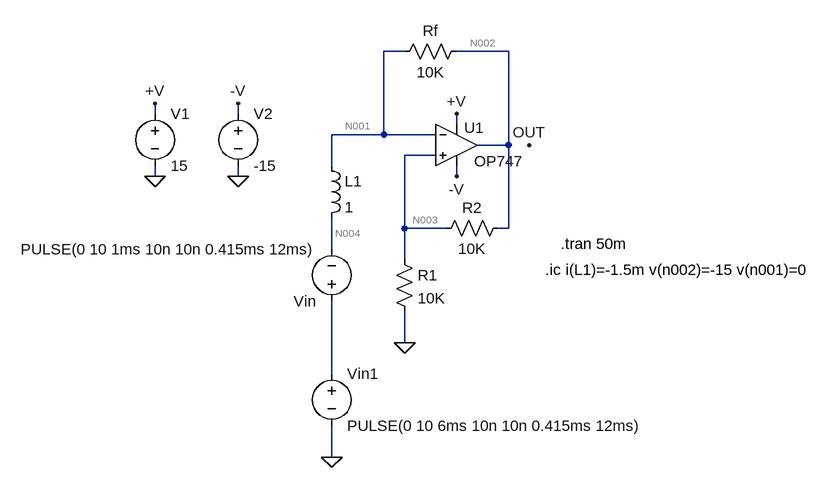
[diagram p0: schematic bistable.asc]
bistable.asc, the LTspice schematic file:
Version 4
SHEET 1 1240 700
WIRE 496 -1248 464 -1248
WIRE 656 -1248 576 -1248
WIRE 112 -1152 112 -1168
WIRE 240 -1152 240 -1168
WIRE 576 -1136 576 -1152
WIRE 464 -1120 464 -1248
WIRE 464 -1120 384 -1120
WIRE 544 -1120 464 -1120
WIRE 656 -1104 656 -1248
WIRE 656 -1104 608 -1104
WIRE 544 -1088 496 -1088
WIRE 384 -1072 384 -1120
WIRE 112 -1056 112 -1072
WIRE 240 -1056 240 -1072
WIRE 576 -1056 576 -1072
WIRE 496 -976 496 -1088
WIRE 560 -976 496 -976
WIRE 656 -976 656 -1104
WIRE 656 -976 640 -976
WIRE 384 -944 384 -992
WIRE 496 -928 496 -976
WIRE 496 -800 496 -848
WIRE 384 -752 384 -864
WIRE 384 -624 384 -672
FLAG 112 -1168 +V
FLAG 112 -1056 0
FLAG 688 -1104 OUT
FLAG 576 -1152 +V
FLAG 240 -1168 -V
FLAG 576 -1056 -V
FLAG 496 -800 0
FLAG 240 -1056 0
FLAG 384 -624 0
SYMBOL voltage 112 -1168 R0
WINDOW 123 0 0 Left 2
WINDOW 39 0 0 Left 2
SYMATTR InstName V1
SYMATTR Value 15
SYMBOL voltage 384 -848 R180
WINDOW 123 0 0 Left 0
WINDOW 39 0 0 Left 0
SYMATTR InstName Vin
SYMATTR Value PULSE(0 10 1ms 10n 10n 0.415ms 12ms)
SYMBOL res 480 -944 R0
SYMATTR InstName R1
SYMATTR Value 10K
SYMBOL res 656 -992 R90
WINDOW 0 0 56 VBottom 2
WINDOW 3 32 56 VTop 2
SYMATTR InstName R2
SYMATTR Value 10K
SYMBOL Opamps\\OP747 576 -1168 R0
WINDOW 0 12 37 Left 2
WINDOW 3 27 89 Left 2
SYMATTR InstName U1
SYMBOL voltage 240 -1168 R0
WINDOW 123 24 146 Left 2
WINDOW 39 24 125 Left 2
SYMATTR InstName V2
SYMATTR Value -15
SYMBOL ind 368 -1088 R0
SYMATTR InstName L1
SYMATTR Value 1
SYMBOL res 592 -1264 R90
WINDOW 0 0 56 VBottom 2
WINDOW 3 32 56 VTop 2
SYMATTR InstName Rf
SYMATTR Value 10K
SYMBOL voltage 384 -768 R0
WINDOW 123 0 0 Left 0
WINDOW 39 0 0 Left 0
SYMATTR InstName Vin1
SYMATTR Value PULSE(0 10 6ms 10n 10n 0.415ms 12ms)
TEXT 736 -952 Left 2 !.tran 50m
TEXT 712 -912 Left 2 !.ic i(L1)=-1.5m v(n002)=-15 v(n001)=0

The netlist it stands for:
* bistable.asc
V1 +V 0 15
Vin N005 N004 PULSE(0 10 1ms 10n 10n 0.415ms 12ms)
R1 N003 0 10K
R2 N002 N003 10K
XU1 N003 N001 +V -V N002 OP747  ; pins In+ In- V+ V- OUT
V2 -V 0 -15
L1 N001 N004 1
Rf N002 N001 10K
Vin1 N005 0 PULSE(0 10 6ms 10n 10n 0.415ms 12ms)
.tran 50m
.ic i(L1)=-1.5m v(n002)=-15 v(n001)=0
.backanno
.end

* Results of the author's LTspice run, read from the files saved beside the schematic
* Operating Point, zero values left out:
*   V(+v) = 15 V
*   V(n003) = -7.5 V
*   V(n002) = -15 V
*   V(-v) = -15 V
*   I(L1) = -1.5 mA
*   I(Rf) = -1.5 mA
*   I(R2) = -750 µA
*   I(R1) = -750 µA
*   I(Vin1) = -1.5 mA
*   I(V2) = 128 µA
*   I(Vin) = 1.5 mA
*   I(V1) = -128 µA
*   Ix(u1:1) = -21.84 nA
*   Ix(u1:2) = 1.022 nA
*   Ix(u1:99) = 128 µA
*   Ix(u1:50) = -128 µA
*   Ix(u1:45) = -60.01 pA
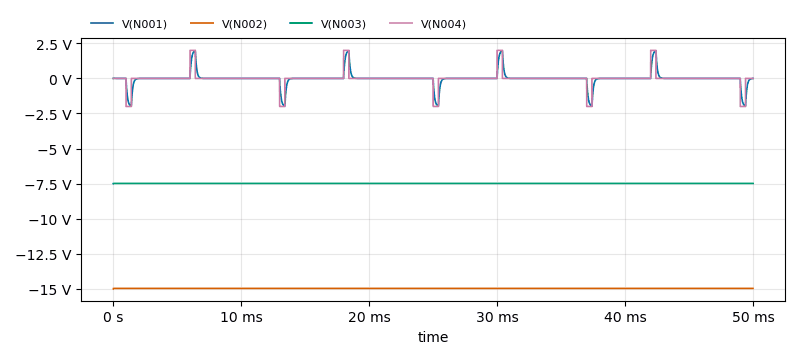
[diagram p1: Transient Analysis of bistable.asc, plotted from the saved traces]
* Transient Analysis, 1 run:
*   V(N001): min -1.971 V, max 1.971 V, average -16.54 mV, rms 477.8 mV, last -5.047 mV
*   V(N002): min -15 V, max -14.97 V, average -14.97 V, rms 14.97 V, last -14.97 V
*   V(N003): min -7.5 V, max -7.484 V, average -7.486 V, rms 7.486 V, last -7.486 V
*   V(N004): min -2 V, max 2 V, average -16.6 mV, rms 546.6 mV, last 0 V